# EAGLE design Power_board_rev_2 (EAGLE 7.3.0)

## Sheet 1 of 6
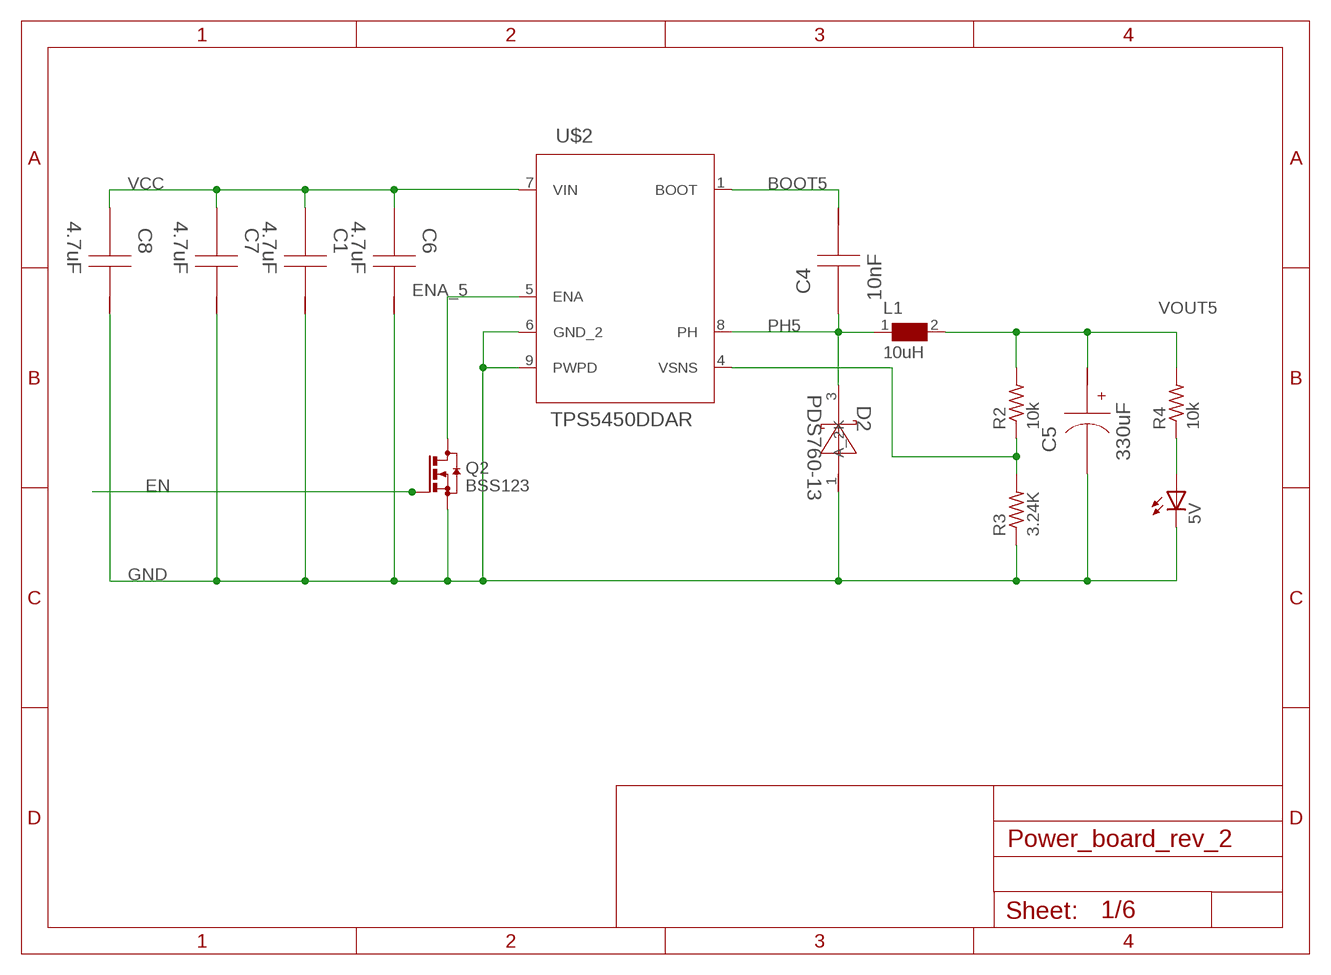
[diagram p0: schematic, sheet 1]

### Parts
5V  LEDSML1206  [SML1206]
C1  4.7uF  GRM31CR71H475KA12L  [1206]
C4  10nF  C0805C103K5RACTU  [0805]
C5  330uF  10SVP330MX  [SM_RADIAL_10AMM]
C6  4.7uF  GRM31CR71H475KA12L  [1206]
C7  4.7uF  GRM31CR71H475KA12L  [1206]
C8  4.7uF  GRM31CR71H475KA12L  [1206]
D2  PDS760-13  [POWERDI5]
L1  10uH  WE-HCC-7443331000_1090  [WE-HCC_1090]
Q2  BSS123  [SOT23]
R2  10k  R-US_R1206  [R1206]
R3  3.24K  R-US_R1206  [R1206]
R4  10k  R-US_R1206  [R1206]
U$2  TPS5450DDAR  [R-PDSO-G8]

### Nets
BOOT5: C4.1 U$2.1(BOOT)
EN: Q2.1(G) ; also sheet 2,3,6
ENA_5: Q2.3(D) U$2.5(ENA)
FB5: 5V.A R4.1
GND: 5V.C C1.1 C5.2(-) C6.1 C7.1 C8.1 D2.1(A_2) Q2.2(S) R3.1 U$2.6(GND_2) U$2.9(PWPD) ; also sheet 2,3,4,5,6
PH5: C4.2 D2.3(K) L1.1 U$2.8(PH)
VCC: C1.2 C6.2 C7.2 C8.2 U$2.7(VIN) ; also sheet 2,3,4,5,6
VOUT5: C5.1(+) L1.2 R2.2 R4.2 ; also sheet 5
VSNS5: R2.1 R3.2 U$2.4(VSNS)

## Sheet 2 of 6
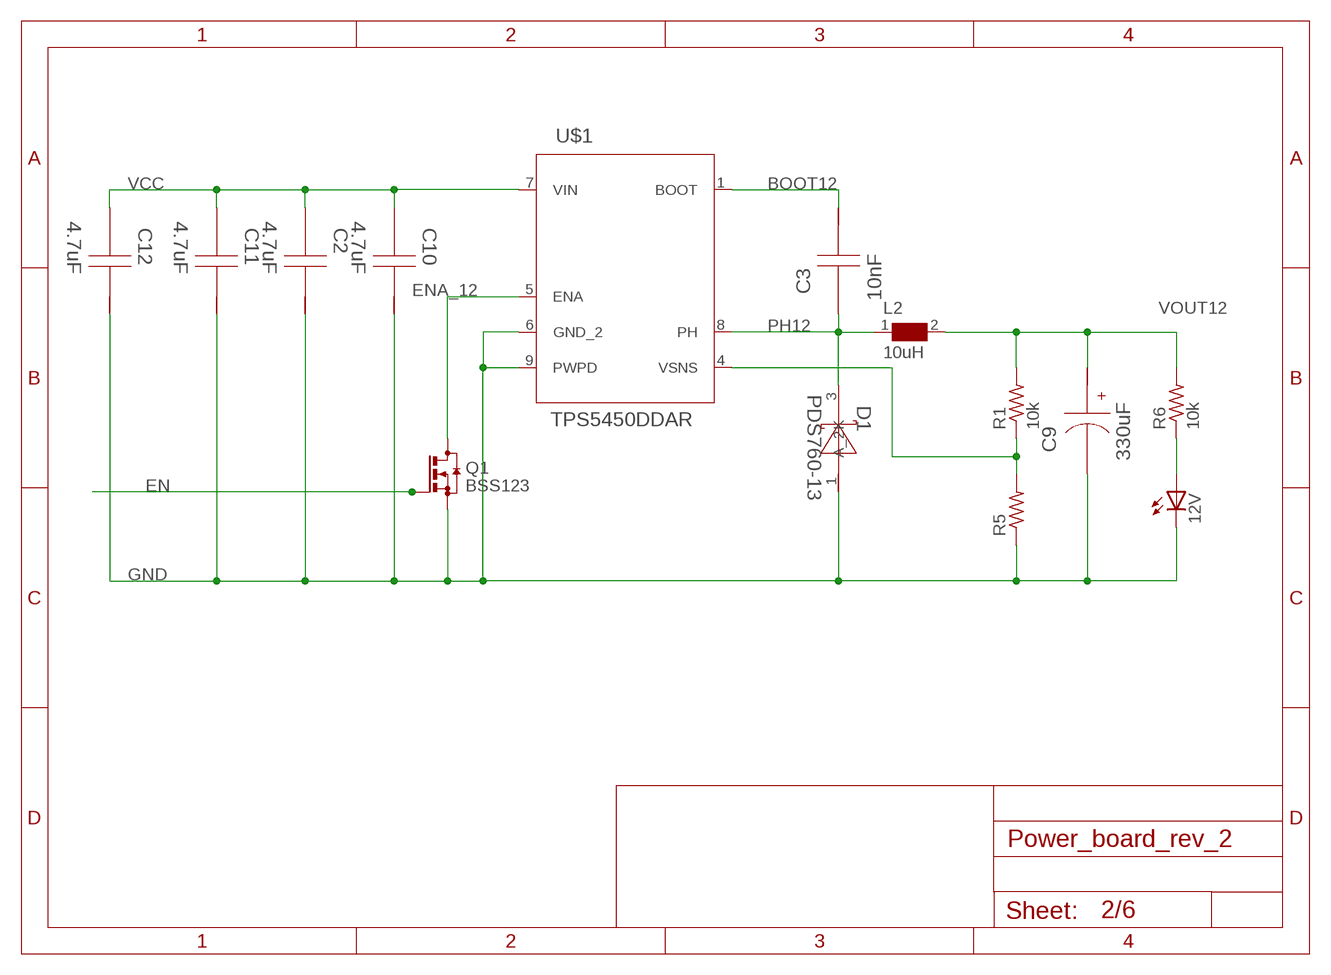
[diagram p1: schematic, sheet 2]

### Parts
12V  LEDSML1206  [SML1206]
C2  4.7uF  GRM31CR71H475KA12L  [1206]
C3  10nF  C0805C103K5RACTU  [0805]
C9  330uF  10SVP330MX  [SM_RADIAL_10AMM]
C10  4.7uF  GRM31CR71H475KA12L  [1206]
C11  4.7uF  GRM31CR71H475KA12L  [1206]
C12  4.7uF  GRM31CR71H475KA12L  [1206]
D1  PDS760-13  [POWERDI5]
L2  10uH  WE-HCC-7443331000_1090  [WE-HCC_1090]
Q1  BSS123  [SOT23]
R1  10k  R-US_R1206  [R1206]
R5  R-US_R1206  [R1206]
R6  10k  R-US_R1206  [R1206]
U$1  TPS5450DDAR  [R-PDSO-G8]

### Nets
BOOT12: C3.1 U$1.1(BOOT)
EN: Q1.1(G) ; also sheet 1,3,6
ENA_12: Q1.3(D) U$1.5(ENA)
FB12: 12V.A R6.1
GND: 12V.C C2.1 C9.2(-) C10.1 C11.1 C12.1 D1.1(A_2) Q1.2(S) R5.1 U$1.6(GND_2) U$1.9(PWPD) ; also sheet 1,3,4,5,6
PH12: C3.2 D1.3(K) L2.1 U$1.8(PH)
VCC: C2.2 C10.2 C11.2 C12.2 U$1.7(VIN) ; also sheet 1,3,4,5,6
VOUT12: C9.1(+) L2.2 R1.2 R6.2 ; also sheet 5
VSNS12: R1.1 R5.2 U$1.4(VSNS)

## Sheet 3 of 6
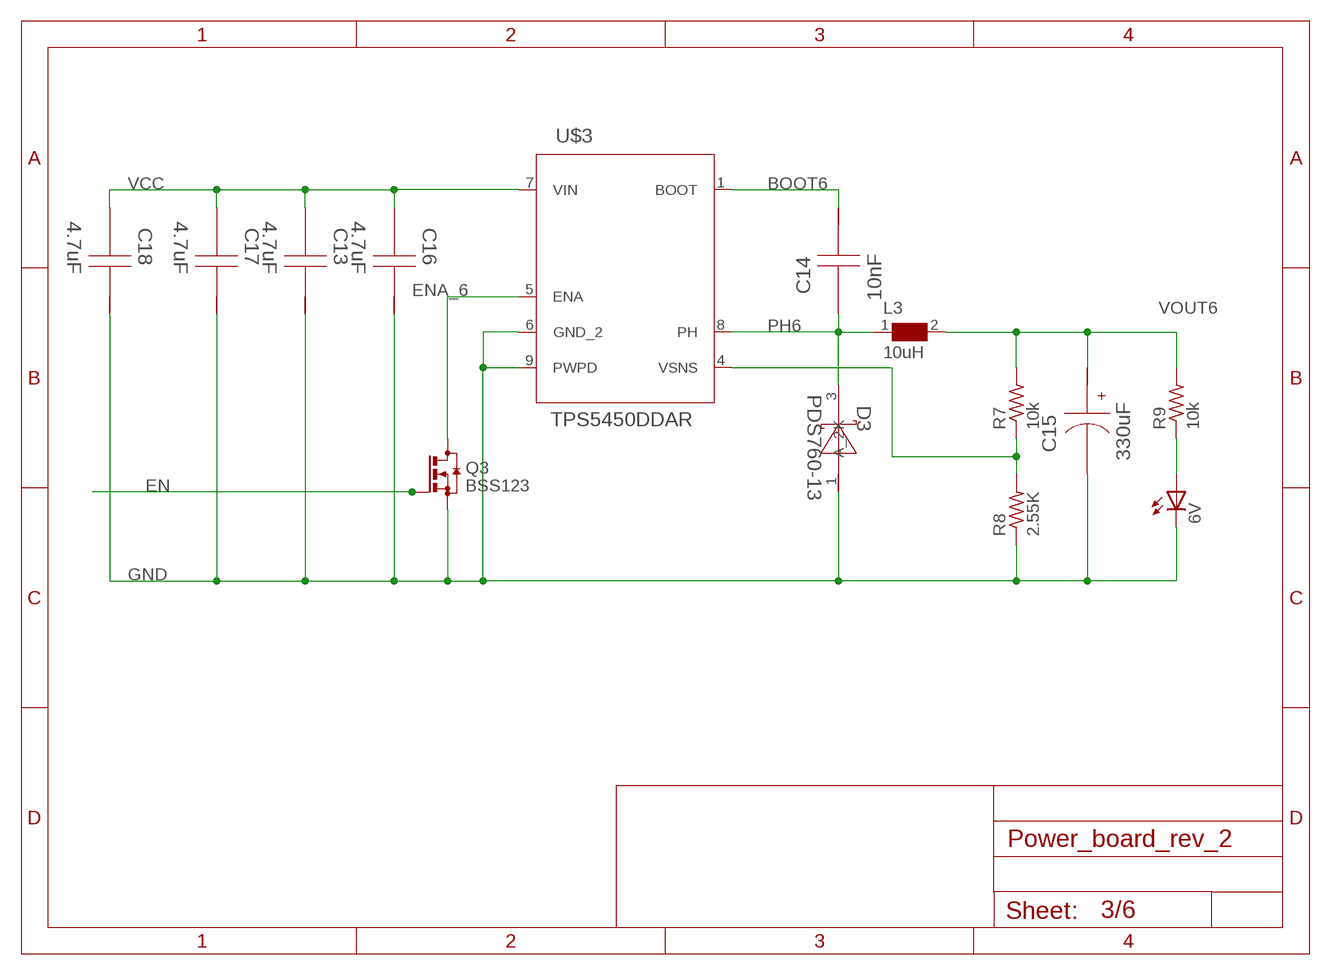
[diagram p2: schematic, sheet 3]

### Parts
6V  LEDSML1206  [SML1206]
C13  4.7uF  GRM31CR71H475KA12L  [1206]
C14  10nF  C0805C103K5RACTU  [0805]
C15  330uF  10SVP330MX  [SM_RADIAL_10AMM]
C16  4.7uF  GRM31CR71H475KA12L  [1206]
C17  4.7uF  GRM31CR71H475KA12L  [1206]
C18  4.7uF  GRM31CR71H475KA12L  [1206]
D3  PDS760-13  [POWERDI5]
L3  10uH  WE-HCC-7443331000_1090  [WE-HCC_1090]
Q3  BSS123  [SOT23]
R7  10k  R-US_R1206  [R1206]
R8  2.55K  R-US_R1206  [R1206]
R9  10k  R-US_R1206  [R1206]
U$3  TPS5450DDAR  [R-PDSO-G8]

### Nets
BOOT6: C14.1 U$3.1(BOOT)
EN: Q3.1(G) ; also sheet 1,2,6
ENA_6: Q3.3(D) U$3.5(ENA)
FB6: 6V.A R9.1
GND: 6V.C C13.1 C15.2(-) C16.1 C17.1 C18.1 D3.1(A_2) Q3.2(S) R8.1 U$3.6(GND_2) U$3.9(PWPD) ; also sheet 1,2,4,5,6
PH6: C14.2 D3.3(K) L3.1 U$3.8(PH)
VCC: C13.2 C16.2 C17.2 C18.2 U$3.7(VIN) ; also sheet 1,2,4,5,6
VOUT6: C15.1(+) L3.2 R7.2 R9.2 ; also sheet 5
VSNS6: R7.1 R8.2 U$3.4(VSNS)

## Sheet 4 of 6
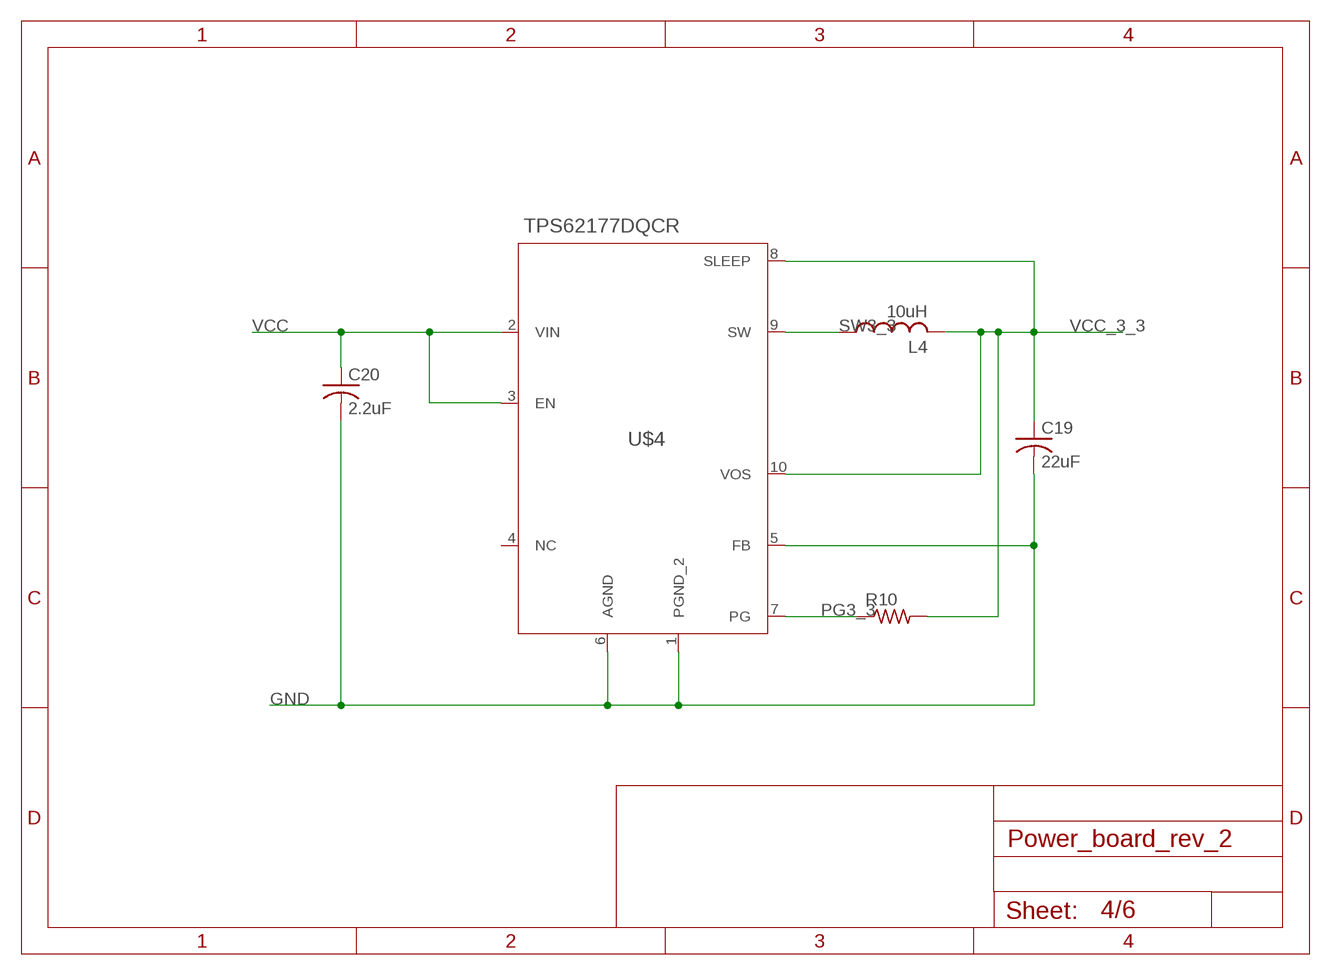
[diagram p3: schematic, sheet 4]

### Parts
C19  22uF  C-USC0805  [C0805]
C20  2.2uF  C-USC1210K  [C1210K]
L4  10uH  L-USWE-TPC  [POWER-CHOKE_WE-TPC]
R10  R-US_R0402  [R0402]
U$4  TPS62177DQCR  [R-PWSON-N10]

### Nets
GND: C19.2 C20.2 U$4.1(PGND_2) U$4.5(FB) U$4.6(AGND) ; also sheet 1,2,3,5,6
PG3_3: R10.1 U$4.7(PG)
SW3_3: L4.1 U$4.9(SW)
VCC: C20.1 U$4.2(VIN) U$4.3(EN) ; also sheet 1,2,3,5,6
VCC_3_3: C19.1 L4.2 R10.2 U$4.8(SLEEP) U$4.10(VOS) ; also sheet 6
Unconnected: U$4.4(NC)

## Sheet 5 of 6
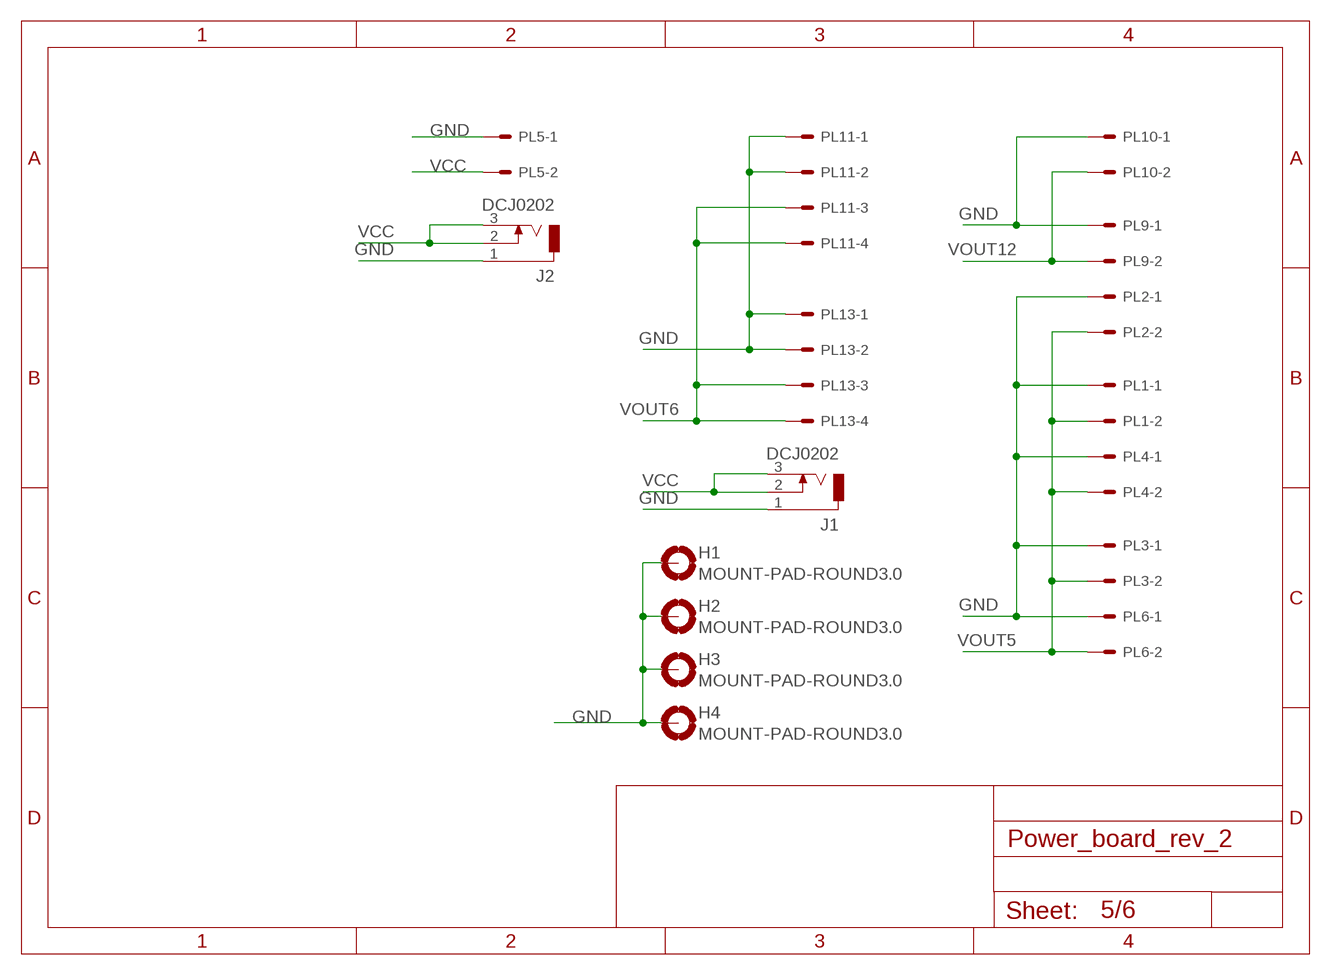
[diagram p4: schematic, sheet 5]

### Parts
H1  MOUNT-PAD-ROUND3.0  [3,0-PAD]
H2  MOUNT-PAD-ROUND3.0  [3,0-PAD]
H3  MOUNT-PAD-ROUND3.0  [3,0-PAD]
H4  MOUNT-PAD-ROUND3.0  [3,0-PAD]
J1  DCJ0202  [DCJ0202]
J2  DCJ0202  [DCJ0202]
PL1  555X-2H  [5569-2]
PL2  555X-2H  [5569-2]
PL3  555X-2H  [5569-2]
PL4  555X-2H  [5569-2]
PL5  555X-2H  [5569-2]
PL6  555X-2H  [5569-2]
PL9  555X-2H  [5569-2]
PL10  555X-2H  [5569-2]
PL11  555X-4H  [5569-4]
PL13  555X-4H  [5569-4]

### Nets
GND: H1.B3,0(MOUNT) H2.B3,0(MOUNT) H3.B3,0(MOUNT) H4.B3,0(MOUNT) J1.1 J2.1 PL1.1 PL2.1 PL3.1 PL4.1 PL5.1 PL6.1 PL9.1 PL10.1 PL11.1 PL11.2 PL13.1 PL13.2 ; also sheet 1,2,3,4,6
VCC: J1.2 J1.3 J2.2 J2.3 PL5.2 ; also sheet 1,2,3,4,6
VOUT5: PL1.2 PL2.2 PL3.2 PL4.2 PL6.2 ; also sheet 1
VOUT6: PL11.3 PL11.4 PL13.3 PL13.4 ; also sheet 3
VOUT12: PL9.2 PL10.2 ; also sheet 2

## Sheet 6 of 6
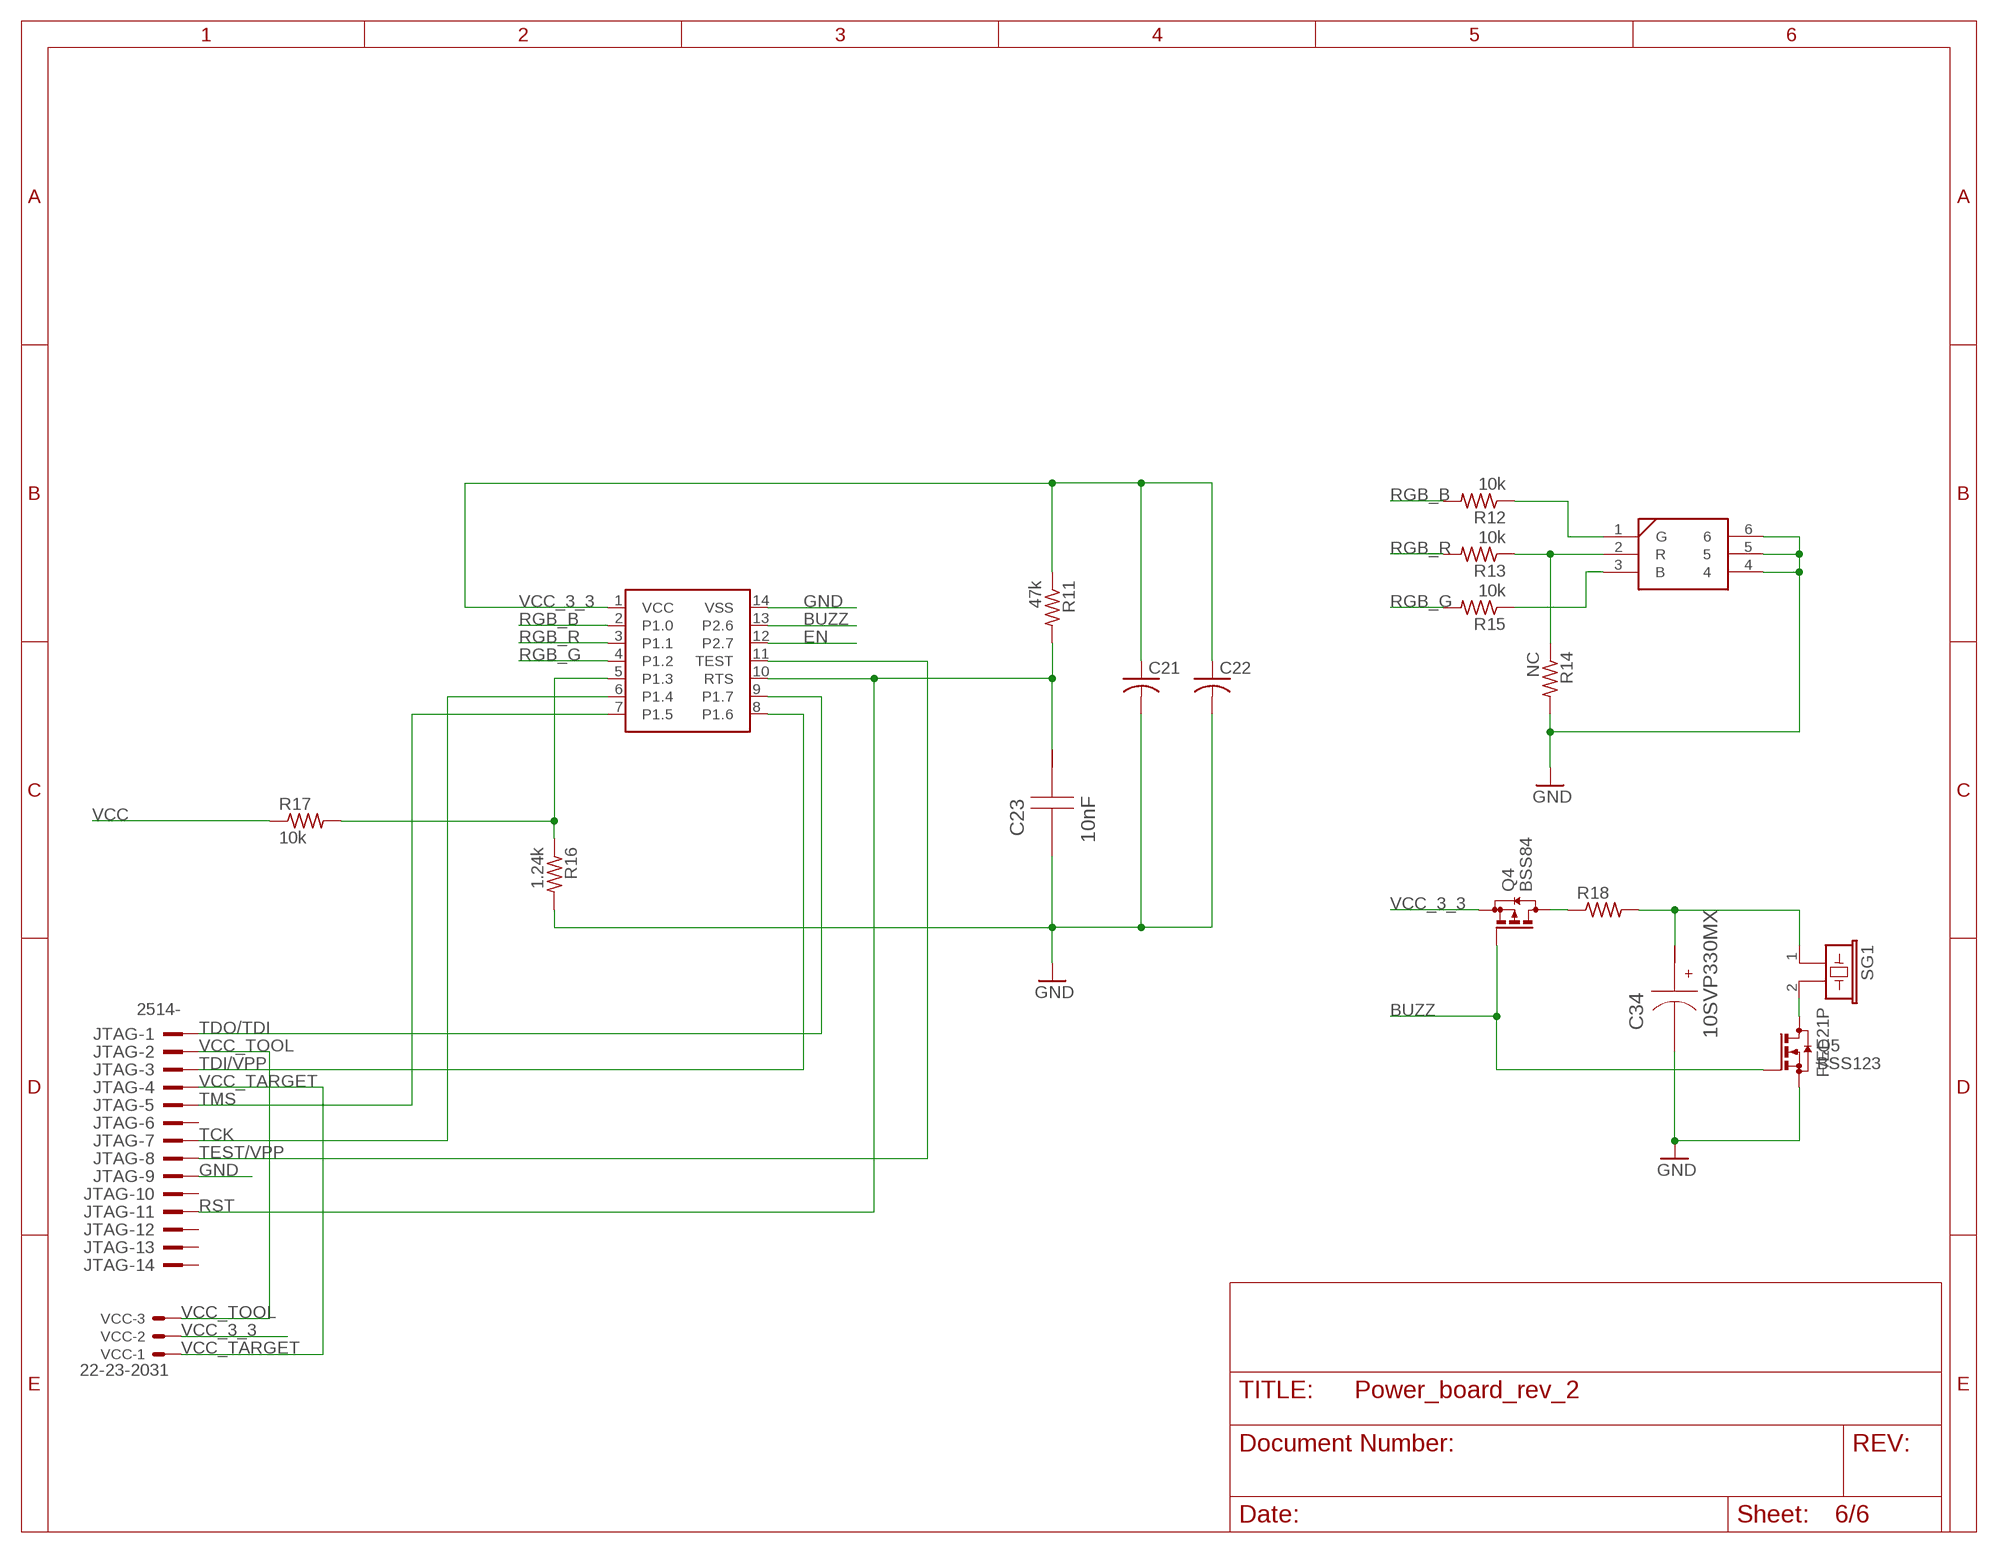
[diagram p5: schematic, sheet 6]

### Parts
C21  C-USC1206K  [C1206K]
C22  C-USC1206K  [C1206K]
C23  10nF  C0805C103K5RACTU  [0805]
C34  10SVP330MX  [SM_RADIAL_10AMM]
JTAG  2514-  [PAK100/2500-14]
Q4  BSS84  [SOT23]
Q5  BSS123  [SOT23]
R11  47k  R-US_R1206W  [R1206W]
R12  10k  R-US_R1206W  [R1206W]
R13  10k  R-US_R1206W  [R1206W]
R14  NC  R-US_R1206W  [R1206W]
R15  10k  R-US_R1206W  [R1206W]
R16  1.24k  R-US_R1206W  [R1206W]
R17  10k  R-US_R1206W  [R1206W]
R18  R-US_R1206W  [R1206W]
SG1  F/EE21P  [F/EE21P]
U$5  MSP430F20X3  [TSSOP-14]
U$7  RGB  [RGB_SMD]
VCC  22-23-2031  [22-23-2031]

### Nets
BUZZ: Q4.1(G) Q5.1(G) U$5.13(P2.6)
EN: U$5.12(P2.7) ; also sheet 1,2,3
GND: C21.2 C22.2 C23.2 C34.2(-) JTAG.9 Q5.2(S) R14.2 R16.2 U$5.14(VSS) U$7.4 U$7.5 U$7.6 ; also sheet 1,2,3,4,5
N$1: Q5.3(D) SG1.2
N$4: R13.1 R14.1 U$7.2(R)
N$5: R15.1 U$7.3(B)
N$6: R12.1 U$7.1(G)
N$7: C34.1(+) R18.2 SG1.1
N$8: R16.1 R17.2 U$5.5(P1.3)
N$10: Q4.3(D) R18.1
RGB_B: R12.2 U$5.2(P1.0)
RGB_G: R15.2 U$5.4(P1.2)
RGB_R: R13.2 U$5.3(P1.1)
RST: C23.1 JTAG.11 R11.2 U$5.10(RTS)
TCK: JTAG.7 U$5.6(P1.4)
TDI/VPP: JTAG.3 U$5.8(P1.6)
TDO/TDI: JTAG.1 U$5.9(P1.7)
TEST/VPP: JTAG.8 U$5.11(TEST)
TMS: JTAG.5 U$5.7(P1.5)
VCC: R17.1 ; also sheet 1,2,3,4,5
VCC_3_3: C21.1 C22.1 Q4.2(S) R11.1 U$5.1(VCC) VCC.2 ; also sheet 4
VCC_TARGET: JTAG.4 VCC.1
VCC_TOOL: JTAG.2 VCC.3
Unconnected: JTAG.6 JTAG.10 JTAG.12 JTAG.13 JTAG.14

## Library data of the parts
5V 6V 12V = led:LED: LED OSRAM: - CHIPLED LG R971, LG N971, LY N971, LG Q971, LY Q971, LO R971, LY R971 LH N974, LH R974 LS Q976, LO Q976, LY Q976 LO Q996 - Hyper CHIPLED LW Q18S LB Q993, LB Q99A, LB R99A - SideLED LS A670, LO A670, LY A670, LG A670, LP A670 LB A673, LV A673, LT A673, LW A673 LH A674 LY A675 LS A676, LA A676, LO A676, LY A676, LW A676 LS A679, LY A679, LG A679 - Hyper Micro SIDELED® LS Y876, LA Y876, LO Y876, LY Y876 LT Y87S - SmartLED LW L88C, LW L88S LB L89C, LB L89S, LG L890 LS L89K, LO L89K, LY L89K LS L896, LA L896, LO L896, LY L896 - TOPLED LS T670, LO T670, LY T670, LG T670, LP T670 LSG T670, LSP T670, LSY T670, LOP T670, LYG T670 LG T671, LOG T671, LSG T671 LB T673, LV T673, LT T673, LW T673 LH T674 LS T676, LA T676, LO T676, LY T676, LB T676, LH T676, LSB T676, LW T676 LB T67C, LV T67C, LT T67C, LS T67K, LO T67K, LY T67K, LW E67C LS E67B, LA E67B, LO E67B, LY E67B, LB E67C, LV E67C, LT E67C LW T67C LS T679, LY T679, LG T679 LS T770, LO T770, LY T770, LG T770, LP T770 LB T773, LV T773, LT T773, LW T773 LH T774 LS E675, LA E675, LY E675, LS T675 LS T776, LA T776, LO T776, LY T776, LB T776 LHGB T686 LT T68C, LB T68C - Hyper Mini TOPLED® LB M676 - Mini TOPLED Santana® LG M470 LS M47K, LO M47K, LY M47K Source: http://www.osram.convergy.de LUXEON: - LUMILED® LXK2-PW12-R00, LXK2-PW12-S00, LXK2-PW14-U00, LXK2-PW14-V00 LXK2-PM12-R00, LXK2-PM12-S00, LXK2-PM14-U00 LXK2-PE12-Q00, LXK2-PE12-R00, LXK2-PE12-S00, LXK2-PE14-T00, LXK2-PE14-U00 LXK2-PB12-K00, LXK2-PB12-L00, LXK2-PB12-M00, LXK2-PB14-N00, LXK2-PB14-P00, LXK2-PB14-Q00 LXK2-PR12-L00, LXK2-PR12-M00, LXK2-PR14-Q00, LXK2-PR14-R00 LXK2-PD12-Q00, LXK2-PD12-R00, LXK2-PD12-S00 LXK2-PH12-R00, LXK2-PH12-S00 LXK2-PL12-P00, LXK2-PL12-Q00, LXK2-PL12-R00 Source: www.luxeon.com KINGBRIGHT: KA-3528ASYC Source: www.kingbright.com
C1 C2 C6-C8 C10-C13 C16-C18 = 5v:GRM31CR71H475KA12L; CAP: 4.7E-6; ESR: 0.0; IRMS: 0.0; MANUFACTURER_NAME: MuRata; MANUFACTURER_PART_NUMBER: GRM31CR71H475KA12L; VDC: 50.0; VENDOR: MuRata
C3 C4 C14 C23 = 5v:C0805C103K5RACTU; CAP: 1.0E-8; ESR: 1.739; IRMS: 0.411; MANUFACTURER_NAME: Kemet; MANUFACTURER_PART_NUMBER: C0805C103K5RACTU; VDC: 50.0; VENDOR: Kemet
C5 C9 C15 C34 = 5v:10SVP330MX; CAP: 3.3E-4; DATASHEETURL: http://www.edc.sanyo.com/english/pdf/oscon/E32.pdf; ESR: 0.025; IRMS: 3.7; MANUFACTURER_NAME: Panasonic; MANUFACTURER_PART_NUMBER: 10SVP330MX; VDC: 10.0; VENDOR: Panasonic
C19-C22 = rcl:C-US: CAPACITOR, American symbol
D1-D3 = 5v:PDS760-13; DATASHEETURL: www.diodes.com/datasheets/ds30477.pdf; IO: 7.0; MANUFACTURER_NAME: Diodes Inc.; MANUFACTURER_PART_NUMBER: PDS760-13; VENDOR: Diodes Inc.; VFATIO: 0.56; VRRM: 60.0
H1-H4 = holes:MOUNT-PAD-ROUND: MOUNTING PAD, round
J1 J2 = con-jack:DCJ0202: DC POWER JACK Source: DCJ0202.pdf; OC_FARNELL: unknown; OC_NEWARK: unknown
JTAG = con-3m:2514-: 3M (TM) Pak 100 4-Wall Header Source: 3M; OC_FARNELL: unknown; OC_NEWARK: unknown
L1-L3 = WE-HCC:WE-HCC: SMD High Current Cube Inductor WE-HCC - magnetically shieled - current capability up to 27A - excellent saturation characteristics -- filter choke for DC/DC converter -- single and polyphase buck converter -- filter choke for motor electronics; MPN: 7443331000; OC_FARNELL: 1848254; OC_NEWARK: 13T9771; PACKAGE: 1090; SUPPLIER: Wuerth Elektronik
L4 = rcl:L-US: INDUCTOR, American symbol
PL1-PL6 PL9 PL10 = con-molex-2:555X-2: Mini FIT connector 2 way
PL11 PL13 = con-molex-2:555X-4: Mini FIT connector 4 way
Q1-Q3 Q5 = transistor-small-signal:BSS123: N-CHANNEL MOS FET
Q4 = transistor-small-signal:BSS84: P-CHANNEL MOS FET
R1-R18 = rcl:R-US_: RESISTOR, American symbol
SG1 = buzzer:F/EE21P: BUZZER Source: Buerklin; OC_FARNELL: unknown; OC_NEWARK: unknown
U$1-U$3 = 5v:TPS5450DDAR; DATASHEETURL: http://www.ti.com/product/tps5450; FREQUENCY: 500000.0; IMAX: 5.0; MANUFACTURER_NAME: Texas Instruments; MANUFACTURER_PART_NUMBER: TPS5450DDA; MKTG_PACKAGE: TPS5450; NSID: TPS5450DDAR; PACKAGE: TPS5450; VENDOR: Texas Instruments
U$4 = TIparts:TPS62177DQCR; DATASHEETURL: http://www.ti.com/product/tps62175; FREQUENCY: 1000000.0; IMAX: 0.5; MANUFACTURER_NAME: Texas Instruments; MANUFACTURER_PART_NUMBER: TPS62175DQCR; MKTG_PACKAGE: TPS62175; NSID: TPS62175DQCR; PACKAGE: TPS62175; VENDOR: Texas Instruments
U$5 = TIparts:MSP430F20X3
U$7 = TIparts:RGB
VCC = con-molex:22-23-2031: .100" (2.54mm) Center Header - 3 Pin; MF: MOLEX; MPN: 22-23-2031; OC_FARNELL: 1462950; OC_NEWARK: 30C0862

## Net classes
0 default: width 0.203 mm, drill 0.508 mm, clearance 0.254 mm

## Board
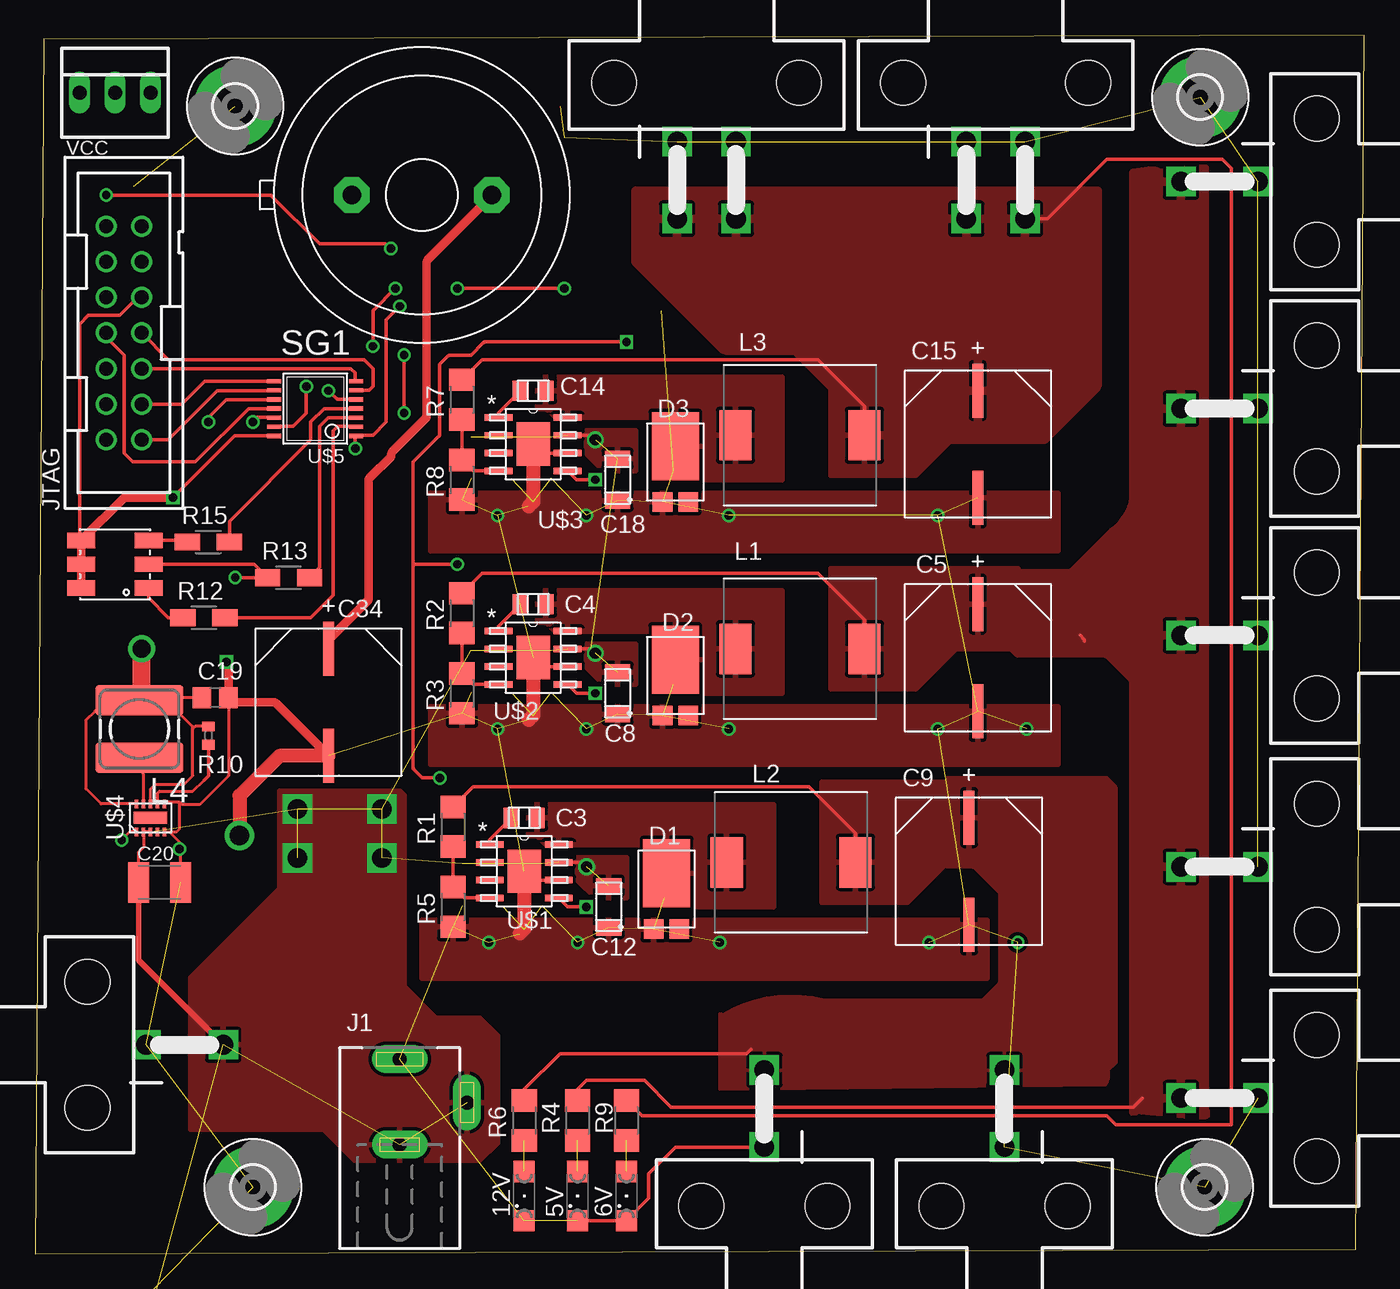
[diagram p6: board, top side]
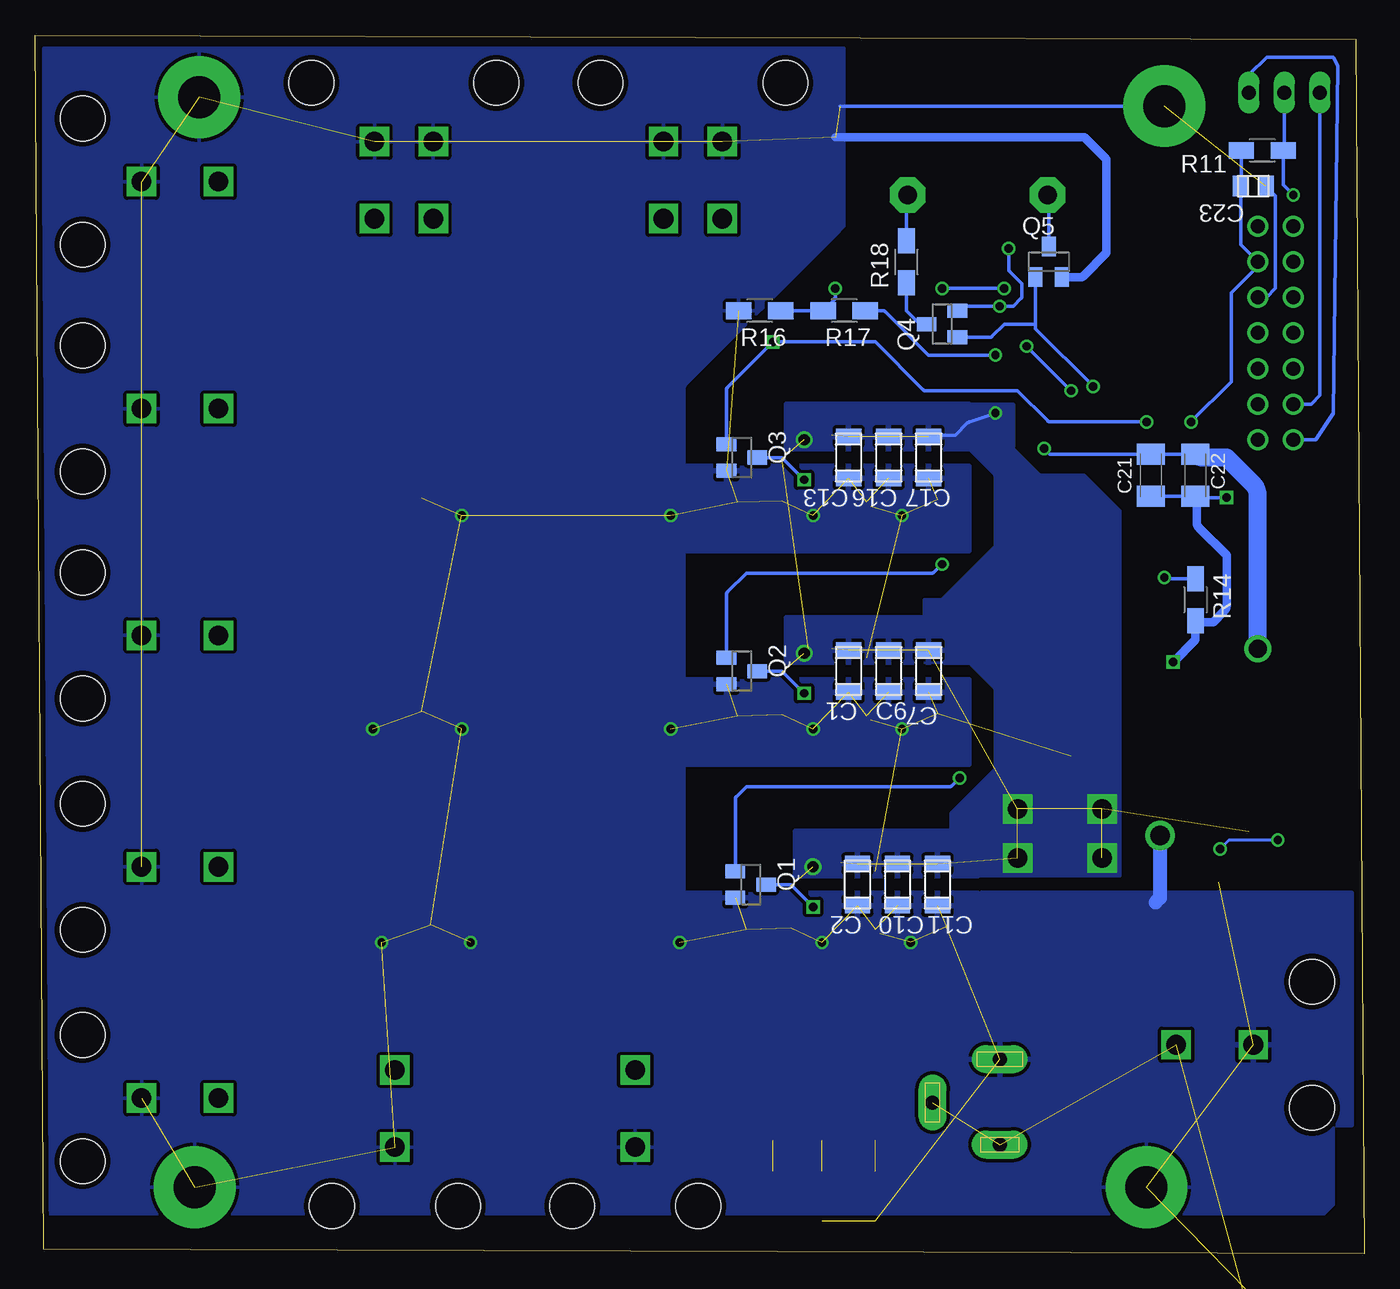
[diagram p7: board, bottom side, seen from below]

Size 94.91 x 86.98 mm. Coordinates in mm from the lower left corner, seen from the top.
Outline: 0,0 94.28,0.32 94.91,86.98 0.63,86.66 0,0
Copper layers (1*16): Top 0.0356mm / dielectric 1.5011mm / Bottom 0.0356mm
Design rules "LaenPCBOrder": minimum track width 6mil, minimum drill 13mil, track to track 6mil, track to pad 6mil, pad to pad 6mil, via to via 6mil, smd to smd 6mil, copper to edge 15mil, drill to drill 6mil, minimum pad ring 7mil, minimum via ring 7mil, stop-mask expansion 3mil, vias tented up to drill 0mil, thermal gap 10mil

### Footprints (pad centres in the part's own frame; a part is rotated, then mirrored left to right if it is on the bottom)
SML1206 = smd 1.5 x 1.5: A 1.75,0; C -1.75,0
1206 = smd 1.118 x 1.803: 1 -1.499,0; 2 1.499,0
0805 = smd 1.118 x 1.448: 1 -0.902,0; 2 0.902,0
SM_RADIAL_10AMM = smd 3.861 x 0.787: 1 -3.823,0; 2 3.823,0
C0805 = smd 1.3 x 1.5: 1 -0.95,0; 2 0.95,0
C1210K = smd 1.5 x 2.9: 1 -1.5,0; 2 1.5,0
C1206K = smd 1.5 x 2: 1 -1.5,0; 2 1.5,0
POWERDI5 = smd 1.397 x 1.397: 1 -0.92,-2.857; 2 0.92,-2.857 | smd 3.353 x 4.851: 3 0,1.13
3,0-PAD = drill 3 pad 5.842: B3,0 0,0
DCJ0202 = drill 1 pad 2 long: 1 0,3.1; 2 4.8,0; 3 0,-3
PAK100/2500-14 = drill 1 pad 1.422: 1 -7.62,-1.27; 2 -7.62,1.27; 3 -5.08,-1.27; 4 -5.08,1.27; 5 -2.54,-1.27; 6 -2.54,1.27; 7 0,-1.27; 8 0,1.27; 9 2.54,-1.27; 10 2.54,1.27; 11 5.08,-1.27; 12 5.08,1.27; 13 7.62,-1.27; 14 7.62,1.27
WE-HCC_1090 = smd 2.3 x 3.6: 1 -4.6,0; 2 4.6,0
POWER-CHOKE_WE-TPC = smd 6.3 x 2.2: 1 0,2.05; 2 0,-2.05
5569-2 = drill 1.4 square: 1 0,0; 2 0,5.5 | hole 3.2: 4.5,-4.2; -4.5,-4.2
5569-4 = drill 1.4 square: 1 2.1,0; 2 -2.1,0; 3 2.1,5.5; 4 -2.1,5.5 | hole 3.2: 6.6,-4.2; -6.6,-4.2
SOT23 = smd 1 x 1.4: 1 -0.95,-1.1; 2 0.95,-1.1; 3 0,1.1
R1206 = smd 1.6 x 1.803: 1 -1.422,0; 2 1.422,0
R0402 = smd 0.7 x 0.9: 1 -0.65,0; 2 0.65,0
R1206W = smd 1.8 x 1.2: 1 -1.499,0; 2 1.499,0
F/EE21P = drill 1.321 pad 2.54 octagon: 1 -5.004,0; 2 5.004,0
R-PDSO-G8 = smd 1.981 x 0.457: 1 -2.464,1.905; 2 -2.464,0.635; 3 -2.464,-0.635; 4 -2.464,-1.905; 5 2.464,-1.905; 6 2.464,-0.635; 7 2.464,0.635; 8 2.464,1.905 | smd 2.388 x 3.099: 9 0,0
R-PWSON-N10 = smd 0.61 x 0.254: 1 -1.003,1; 2 -1.003,0.5; 3 -1.003,0; 4 -1.003,-0.5; 5 -1.003,-1; 6 1.003,-1; 7 1.003,-0.5; 8 1.003,0; 9 1.003,0.5; 10 1.003,1 | smd 0.838 x 2.388: 11 0,0
TSSOP-14 = smd 0.305 x 0.991: 1 -1.95,-2.918; 2 -1.3,-2.918; 3 -0.65,-2.918; 4 0,-2.918; 5 0.65,-2.918; 6 1.3,-2.918; 7 1.95,-2.918; 8 1.95,2.918; 9 1.3,2.918; 10 0.65,2.918; 11 0,2.918; 12 -0.65,2.918; 13 -1.3,2.918; 14 -1.95,2.918
RGB_SMD = smd 2 x 1.1: 1 2.4,-1.7; 2 2.4,0; 3 2.4,1.7; 4 -2.4,1.7; 5 -2.4,0; 6 -2.4,-1.7
22-23-2031 = drill 1 long: 1 -2.54,0; 2 0,0; 3 2.54,0

### Placement (x,y rotation side)
5V  38.73,4.13 90 top
6V  42.23,4.13 90 top
12V  34.92,4.13 90 top
C1  36.83,41.59 90 bottom
C2  36.2,26.35 90 bottom
C3  34.92,31.12 0 top
C4  35.56,46.35 0 top
C5  67.31,42.55 270 top
C6  33.97,41.59 90 bottom
C7  31.12,41.59 90 bottom
C8  41.59,40.01 90 top
C9  66.67,27.3 270 top
C10  33.34,26.35 90 bottom
C11  30.48,26.35 90 bottom
C12  40.96,24.77 90 top
C13  36.83,56.83 90 bottom
C14  35.56,61.6 0 top
C15  67.31,57.78 270 top
C16  33.97,56.83 90 bottom
C17  31.12,56.83 90 bottom
C18  41.59,55.24 90 top
C19  12.86,39.69 0 top
C20  8.89,26.51 0 top
C21  15.24,55.56 270 bottom
C22  12.07,55.56 270 bottom
C23  7.94,76.2 0 bottom
C34  20.96,39.37 270 top
D1  45.09,26.04 0 top
D2  45.72,41.27 0 top
D3  45.72,56.52 0 top
H1  14.29,81.92 0 top
H2  83.19,82.55 0 top
H3  83.5,4.76 0 top
H4  15.56,4.76 0 top
J1  26.04,10.79 0 top
J2  0.95,-13.34 0 top  (outside the outline)
JTAG  6.35,65.72 90 top
L1  54.61,43.18 0 top
L2  53.98,27.94 0 top
L3  54.61,58.42 0 top
L4  7.46,37.46 180 top
PL1  87.31,76.52 90 top
PL2  87.31,60.32 90 top
PL3  87.31,44.13 90 top
PL4  87.31,27.62 90 top
PL5  7.94,14.92 270 top
PL6  87.31,11.11 90 top
PL9  52.07,7.62 0 top
PL10  69.22,7.62 0 top
PL11  47.94,79.38 180 top
PL13  68.58,79.38 180 top
Q1  43.81,26.35 270 bottom
Q2  44.45,41.59 270 bottom
Q3  44.45,56.83 270 bottom
Q4  30.16,66.36 90 bottom
Q5  22.54,70.8 0 bottom
R1  29.84,30.48 90 top
R2  30.48,45.72 90 top
R3  30.48,40.01 90 top
R4  38.73,9.52 90 top
R5  29.84,24.77 90 top
R6  34.92,9.52 90 top
R7  30.48,60.96 90 top
R8  30.48,55.24 90 top
R9  42.23,9.52 90 top
R10  12.38,36.99 90 top
R11  7.3,78.74 180 bottom
R12  12.07,45.4 0 top
R13  18.1,48.26 0 top
R14  12.07,46.67 270 bottom
R15  12.38,50.8 0 top
R16  43.18,67.31 180 bottom
R17  37.15,67.31 180 bottom
R18  32.7,70.8 90 bottom
SG1  27.62,75.57 180 top
U$1  34.92,27.3 0 top
U$2  35.56,42.55 0 top
U$3  35.56,57.78 0 top
U$4  8.26,31.12 90 top
U$5  20,60.32 90 top
U$7  5.71,49.21 0 top
VCC  5.71,82.87 0 top

### Tracks (layer width: path | path; a pad name or v marks a point on that pad's centre or on a via)
BOOT5
  Top 0.254: U$2.1 33.1,44.79 C4.1
BOOT6
  Top 0.254: U$3.1 33.1,60.03 C14.1
BOOT12
  Top 0.254: U$1.1 32.46,29.55 C3.1
BUZZ  (via drill 0.6)
  Top 0.254: v19.37,61.91 19.37,60.01 18.41,59.06 17.11,59.06 U$5.13
  Bottom 0.254: Q5.1 23.49,66.36 | 23.49,66.36 23.49,66.04 v19.37,61.91 | Q4.1 26.77,65.41 arc-45 26.59,65.48 25.72,66.36 23.49,66.36
EN  (via drill 0.6)
  Top 0.254: v28.89,33.97 27.62,33.97 27.06,34.53 arc-45 26.99,34.71 26.99,49.21 | v30.16,49.21 26.99,49.21 | v42.23,65.09 32.17,65.09 arc45 31.99,65.01 31.12,64.13 29.63,64.13 arc45 29.45,64.06 28.89,63.5 28.89,58.53 arc-45 28.82,58.35 26.99,56.52 26.99,49.21 | U$5.12 17.07,59.69 15.87,59.69 v15.56,59.37
  Bottom 0.254: Q1.1 44.91,32.45 arc45 44.84,32.63 44.13,33.34 29.63,33.34 arc-45 29.45,33.41 v28.89,33.97 | Q2.1 45.55,47.05 arc45 45.48,47.23 44.13,48.58 30.9,48.58 arc-45 30.72,48.65 v30.16,49.21 | Q3.1 45.55,61.66 arc45 45.48,61.84 v42.23,65.09 34.92,65.09 31.51,61.67 arc-45 31.33,61.6 24.76,61.6 22.62,59.45 arc-45 22.44,59.37 v15.56,59.37
ENA_5  (via drill 0.6)
  Top 0.254: v40.01,40.01 38.66,40.01 U$2.5
  Bottom 0.254: Q2.3 41.59,41.59 v40.01,40.01
ENA_6  (via drill 0.6)
  Top 0.254: v40.01,55.24 38.66,55.24 U$3.5
  Bottom 0.254: Q3.3 41.59,56.83 v40.01,55.24
ENA_12  (via drill 0.6)
  Top 0.254: v39.37,24.77 38.02,24.77 U$1.5
  Bottom 0.254: Q1.3 40.96,26.35 v39.37,24.77
FB5  (1 unrouted)
FB6  (1 unrouted)
FB12  (1 unrouted)
GND  (via drill 0.6, 1.4)  (62 unrouted)
  Top 0.203: U$4.1 6.78,30.11 v6.19,29.53 | 10.32,32.23 9.36,32.23 U$4.6 | 10.32,32.23 10.32,30.32 10.11,30.11 U$4.5 9.58,30.11 10.32,29.37 v10.32,28.89 10.39,28.82 C20.2 | C19.2 13.81,34.13 11.75,32.07 10.48,32.07 10.32,32.23
  Top 0.254: U$2.6 35.56,41.91 | U$1.6 34.92,26.67 | U$3.6 35.56,57.15 | U$5.14 14.24,58.38 v9.84,53.98 | JTAG.9 7.43,68.26 arc45 7.21,68.17 6.03,66.99 3.81,66.99 3.18,66.36 3.18,51.18 arc45 3.27,50.96 U$7.4 | PL9.1 45.72,7.62 43.81,5.72 43.81,3.97 6V.C | 42.39,2.54 6V.C | 6V.C 5V.C
  Top 0.61: v9.84,53.98 6.38,53.98 U$7.4 U$7.5 U$7.6 | v13.65,42.23 arc-45 13.81,41.85 C19.2 13.94,39.56 arc45 14.39,39.37 17.03,39.37 arc-45 17.21,39.3 C34.2
  Top 1.016: U$2.9 35.56,41.91 35.56,38.42 35.24,38.1 | U$1.9 34.92,26.67 34.92,23.18 34.61,22.86 | U$3.9 35.56,57.15 35.56,53.66 35.24,53.34 | C34.2 17.45,35.55 14.6,32.7 v14.6,29.84
  Bottom 0.203: v6.19,29.53 9.68,29.53 v10.32,28.89
  Bottom 0.254: JTAG.9 6.98,68.26 6.35,68.9 6.35,75.51 C23.2 | C21.2 C22.2 11.98,53.98 v9.84,53.98 | H1.B3,0 37.47,81.91
  Bottom 0.61: v13.65,42.23 12.07,43.81 R14.2 arc-45 11.85,45.09 10.79,45.09 10.03,45.85 arc-45 9.84,46.3 9.84,49.85 11.79,51.8 arc45 11.98,52.25 11.98,53.98 | Q5.2 20.26,69.7 arc-45 20.08,69.78 18.41,71.44 18.41,78 arc-45 18.49,78.18 20,79.69 37.78,79.69
  Bottom 1.016: v14.6,29.84 14.6,25.4 14.92,25.08
  other vias: 33.02,37.46 39.37,37.46 49.53,37.46 64.45,37.46 70.8,37.46 32.38,22.22 38.73,22.22 48.9,22.22 63.82,22.22 70.17,22.22 33.02,52.7 39.37,52.7 49.53,52.7 64.45,52.7
  pour Bottom: 28.26,40.96 80.01,40.96 80.01,34.92 28.26,34.92
  pour Top: 28.26,39.05 73.03,39.05 73.03,34.92 28.26,34.92
  pour Bottom: 27.62,25.72 79.38,25.72 79.38,19.68 27.62,19.68
  pour Top: 27.62,23.81 67.95,23.81 67.95,19.68 27.62,19.68
  pour Bottom: 28.26,56.2 80.01,56.2 80.01,50.16 28.26,50.16
  pour Top: 28.26,54.29 73.03,54.29 73.03,50.16 28.26,50.16
  pour Bottom: 37.15,86.04 94.3,86.04 94.3,2.86 2.96,2.86 arc-45 2.78,2.93 2.22,3.49 2.22,10.48 39.58,10.48 arc45 39.76,10.55 48.58,19.37 48.58,61.81 arc45 48.5,61.99 37.78,72.71 37.15,73.34
  pour Bottom: 27.3,25.72 0.95,25.72 0.95,23.18 0.95,9.21 60.96,9.21 60.96,25.4 27.3,25.4
N$1
  Bottom 0.254: Q5.3 22.54,75.49 SG1.2
N$4  (via drill 0.6)
  Top 0.254: U$7.2 15.65,49.21 16.24,48.62 | 16.24,48.62 R13.1 | v14.29,48.26 15.87,48.26 16.24,48.62
  Bottom 0.254: R14.1 14.2,48.17 v14.29,48.26
N$5
  Top 0.254: U$7.3 10.77,50.91 R15.1
N$6
  Top 0.254: U$7.1 8.11,46.81 9.52,45.4 R12.1
N$7
  Top 0.61: SG1.1 28.13,71.06 arc45 27.94,70.62 27.94,59.69 25.6,57.35 arc45 25.41,56.9 23.89,55.37 arc45 23.81,55.19 23.81,46.67 21.03,43.89 arc45 20.96,43.71 C34.1
  Bottom 0.254: R18.2 32.7,75.49 SG1.1
N$8  (via drill 0.6)
  Top 0.254: U$5.5 21.68,60.98 arc-45 21.5,61.05 v20.96,61.6 | v24.13,64.77 24.13,67.2 arc-45 24.2,67.38 v25.72,68.9 | v30.16,68.9 v37.78,68.9
  Bottom 0.254: R16.1 R17.2 37.86,68.1 arc-45 37.78,68.28 v37.78,68.9 | v20.96,61.6 v24.13,64.77 | v25.72,68.9 v30.16,68.9
N$10
  Bottom 0.254: Q4.3 31.75,66.36 32.7,67.31 R18.1
PG3_3
  Top 0.203: U$4.7 8.76,32.88 8.89,33.02 11.27,33.02 12.07,33.81
  Top 0.254: 12.07,33.81 12.38,34.13 R10.1
PH5
  pour Top: 35.88,47.31 35.88,45.09 36.51,45.09 37.15,44.45 43.81,44.45 46.99,40.01 53.34,40.01 53.34,47.31
PH6
  pour Top: 35.88,62.55 35.88,60.32 36.51,60.32 37.15,59.69 43.81,59.69 46.99,55.24 53.34,55.24 53.34,62.55
PH12
  pour Top: 35.24,32.07 35.24,29.84 35.88,29.84 36.51,29.21 43.18,29.21 46.36,24.77 52.7,24.77 52.7,32.07
RGB_B
  Top 0.254: R12.2 19.69,45.4 21.27,46.99 21.27,58.74 21.59,59.06 22.89,59.06 U$5.2
RGB_G
  Top 0.254: R15.2 13.88,52.3 19.69,58.1 19.69,59.37 20.64,60.32 U$5.4
RGB_R
  Top 0.254: 22.94,59.69 U$5.3 20.94,59.68 20.32,59.06 20.32,48.98 R13.2
RST  (via drill 0.6)
  Top 0.254: v12.38,59.37 12.38,59.69 13.65,60.96 17.07,60.96 U$5.10
  Bottom 0.254: v12.38,59.37 9.52,62.23 9.52,68.58 7.62,70.48 JTAG.11 8.84,72.02 C23.1 8.8,76.24 R11.2
SW3_3
  Top 0.203: U$4.9 7.76,34.17 L4.1
TCK
  Top 0.254: U$5.6 23.84,61.62 24.13,61.91 24.13,63.18 23.5,63.82 9.52,63.82 JTAG.7
TDI/VPP
  Top 0.254: U$5.8 12.11,62.27 10.48,60.64 JTAG.3
TDO/TDI
  Top 0.254: JTAG.1 9.52,58.1 13.02,61.6 17.05,61.6 U$5.9
TEST/VPP
  Top 0.254: JTAG.8 5.08,65.4 6.35,64.13 6.35,57.15 6.98,56.52 11.43,56.52 15.24,60.32 U$5.11
TMS
  Top 0.254: U$5.7 22.86,62.34 22.86,62.87 22.54,63.18 JTAG.5
VCC  (via drill 0.6, 0.8, 1.4)  (23 unrouted)
  Top 0.203: U$4.3 U$4.2 7.78,30.09 7.78,29.05 7.39,28.66 C20.1
  Top 0.254: U$2.7 39.69,43.18 v40.01,42.86 | U$1.7 39.37,27.94 v39.37,27.62 | U$3.7 40.01,58.42 v40.01,58.1 | v26.35,64.13 v26.35,60.01
  Top 0.406: C20.1 7.39,20.97 PL5.2
  Bottom 0.254: R17.1 34.4,67.31 arc45 34.22,67.24 31.12,64.13 v26.35,64.13 | v26.35,60.01 28.15,59.37 arc-45 28.33,59.3 29.21,58.42 30.92,58.42 arc-45 31.1,58.35 C17.2
  other vias: 18.73,31.75 18.73,28.26 24.77,28.26 24.77,31.75
  pour Bottom: 28.26,42.23 41.27,42.23 41.27,45.4 28.26,45.4
  pour Top: 39.37,41.91 39.37,43.5 42.86,43.5 42.86,40.64 40.64,40.64
  pour Bottom: 27.62,26.99 40.64,26.99 40.64,30.16 27.62,30.16
  pour Top: 38.73,26.67 38.73,28.26 42.23,28.26 42.23,25.4 40.01,25.4
  pour Bottom: 28.26,57.47 41.27,57.47 41.27,60.64 28.26,60.64
  pour Top: 39.37,57.15 39.37,58.74 42.86,58.74 42.86,55.88 40.64,55.88
  pour Bottom: 29.53,57.47 29.53,60.64 25.08,60.64 25.08,57.57 arc-45 25.01,57.39 23.18,55.56 20.11,55.56 arc45 19.93,55.49 17.46,53.02 17.46,26.99 29.53,26.99 29.53,31.33 arc45 29.45,31.51 26.35,34.61 26.35,40.22 arc-45 26.43,40.4 28.26,42.23 31.43,42.23 31.43,46.67 30.27,46.67 arc-45 30.09,46.75 26.35,50.48 26.35,55.46 arc-45 26.43,55.64 28.26,57.47
  pour Top: 17.46,33.02 17.46,26.04 11.11,19.68 11.11,8.89 20.64,8.89 22.86,6.67 31.75,6.67 33.02,7.94 33.02,15.56 31.75,16.83 28.57,16.83 26.35,19.05 26.35,32.7 26.04,33.02
VCC_3_3  (via drill 0.6, 1.3)
  Top 0.203: U$4.10 4.71,32.12 3.65,33.18 3.65,38.1 4.29,38.74 7.29,38.74 L4.2 | L4.2 7.32,38.74 10.16,38.74 11.27,37.62 11.27,37.46 | U$4.8 8.26,33.18 8.57,33.5 10.64,33.5 11.27,34.13 11.27,37.46 | 11.27,37.46 11.44,37.64 R10.2 12.21,37.78 | C19.1 7.63,39.69 L4.2
  Top 0.254: v5.08,75.57 16.72,75.57 arc-45 16.9,75.49 20.32,72.07 24.98,72.07 arc-45 25.16,72 v25.4,71.76 | v26.03,67.63 25.08,66.68 25.08,59.37 24.13,58.42 22.97,58.42 U$5.1 22.86,58.31 v22.86,57.47
  Top 1.27: 7.63,39.69 7.63,43.15 arc45 v7.62,43.18
  Bottom 0.254: VCC.2 5.72,78.83 R11.1 5.8,76.29 v5.08,75.57 | Q4.2 28.74,67.63 v26.03,67.63 25.08,67.63 24.52,68.19 arc-45 24.45,68.37 24.45,69.21 25.33,70.09 arc45 25.4,70.27 v25.4,71.76 | v22.86,57.47 22.46,57.06 C21.1 C22.1
  Bottom 1.27: v7.62,43.18 7.62,54.08 arc-45 7.99,54.98 9.84,56.83 11.51,56.83 arc45 C22.1
VCC_TARGET
  Bottom 0.254: VCC.1 3.18,61.28 3.81,60.64 JTAG.4
VCC_TOOL
  Bottom 0.254: VCC.3 8.26,84.14 6.98,85.41 2.22,85.41 1.91,84.77 2.22,60.01 3.49,58.1 JTAG.2
VOUT5
  Top 0.254: R2.2 31.92,48.58 55.88,48.58 59.21,45.25 L1.2 | 74.93,43.71 arc45 74.86,43.89 74.61,44.13 | 79.06,11.11 78.42,10.48 45.4,10.48 43.5,12.38 39.37,12.38 38.73,11.75 R4.2
  pour Top: 56.83,48.89 56.83,40.32 62.87,40.32 65.72,43.18 70.17,43.18 70.17,48.89
  pour Top: 70.17,42.86 76.25,42.86 arc-45 76.7,42.68 78.42,40.96 78.42,10.11 arc45 78.61,10.29 79.69,10.16 83.24,9.84 arc45 83.69,10.03 83.5,10.16 83.5,77.47 80.27,77.15 arc45 79.51,77.28 78.42,77.15 78.42,53.92 arc-45 76.97,51.57 73.98,48.58 69.53,48.58 69.53,43.76 arc45 69.72,43.31
VOUT6
  Top 0.254: R7.2 31.92,63.82 55.88,63.82 59.21,60.49 L3.2 | PL13.4 72.29,73.87 76.52,78.1 84.77,78.1 85.41,77.47 85.41,9.21 77.15,9.21 76.52,9.84 43.33,9.84 R9.2
  pour Top: 56.83,64.14 56.83,55.56 62.87,55.56 65.72,58.42 70.17,58.42 70.17,64.14
  pour Top: 42.86,75.88 75.88,75.88 75.88,63.18 75.88,62.18 arc-45 75.7,61.73 72.07,58.1 60.91,58.1 arc-45 60.46,58.29 54.29,64.45 49.48,64.45 arc-45 49.03,64.64 42.86,70.8
VOUT12
  Top 0.254: R1.2 31.28,33.34 55.24,33.34 58.58,30.01 L2.2 | 51.12,14.61 50.8,14.29 37.47,14.29 34.92,11.75 R6.2
  pour Top: 56.2,33.66 56.2,25.08 62.23,25.08 65.09,27.94 69.53,27.94 69.53,33.66
  pour Top: 65.09,27.62 66.89,27.62 arc-45 67.07,27.55 68.9,25.72 68.9,19.47 arc-45 68.82,19.29 67.63,18.1 56.3,18.1 arc45 49.14,17.07 48.9,17.14 48.9,11.75 76.41,12.06 arc45 76.59,13.09 77.15,13.65 77.15,33.23 arc45 77.08,33.41 76.52,33.97 65.09,33.97
VSNS5
  Top 0.254: R2.1 R3.2 31.27,40.64 U$2.4
VSNS6
  Top 0.254: R7.1 R8.2 31.27,55.88 U$3.4
VSNS12
  Top 0.254: R1.1 R5.2 30.63,25.4 U$1.4